# EasyEDA schematic hv-testbench-schematic.json
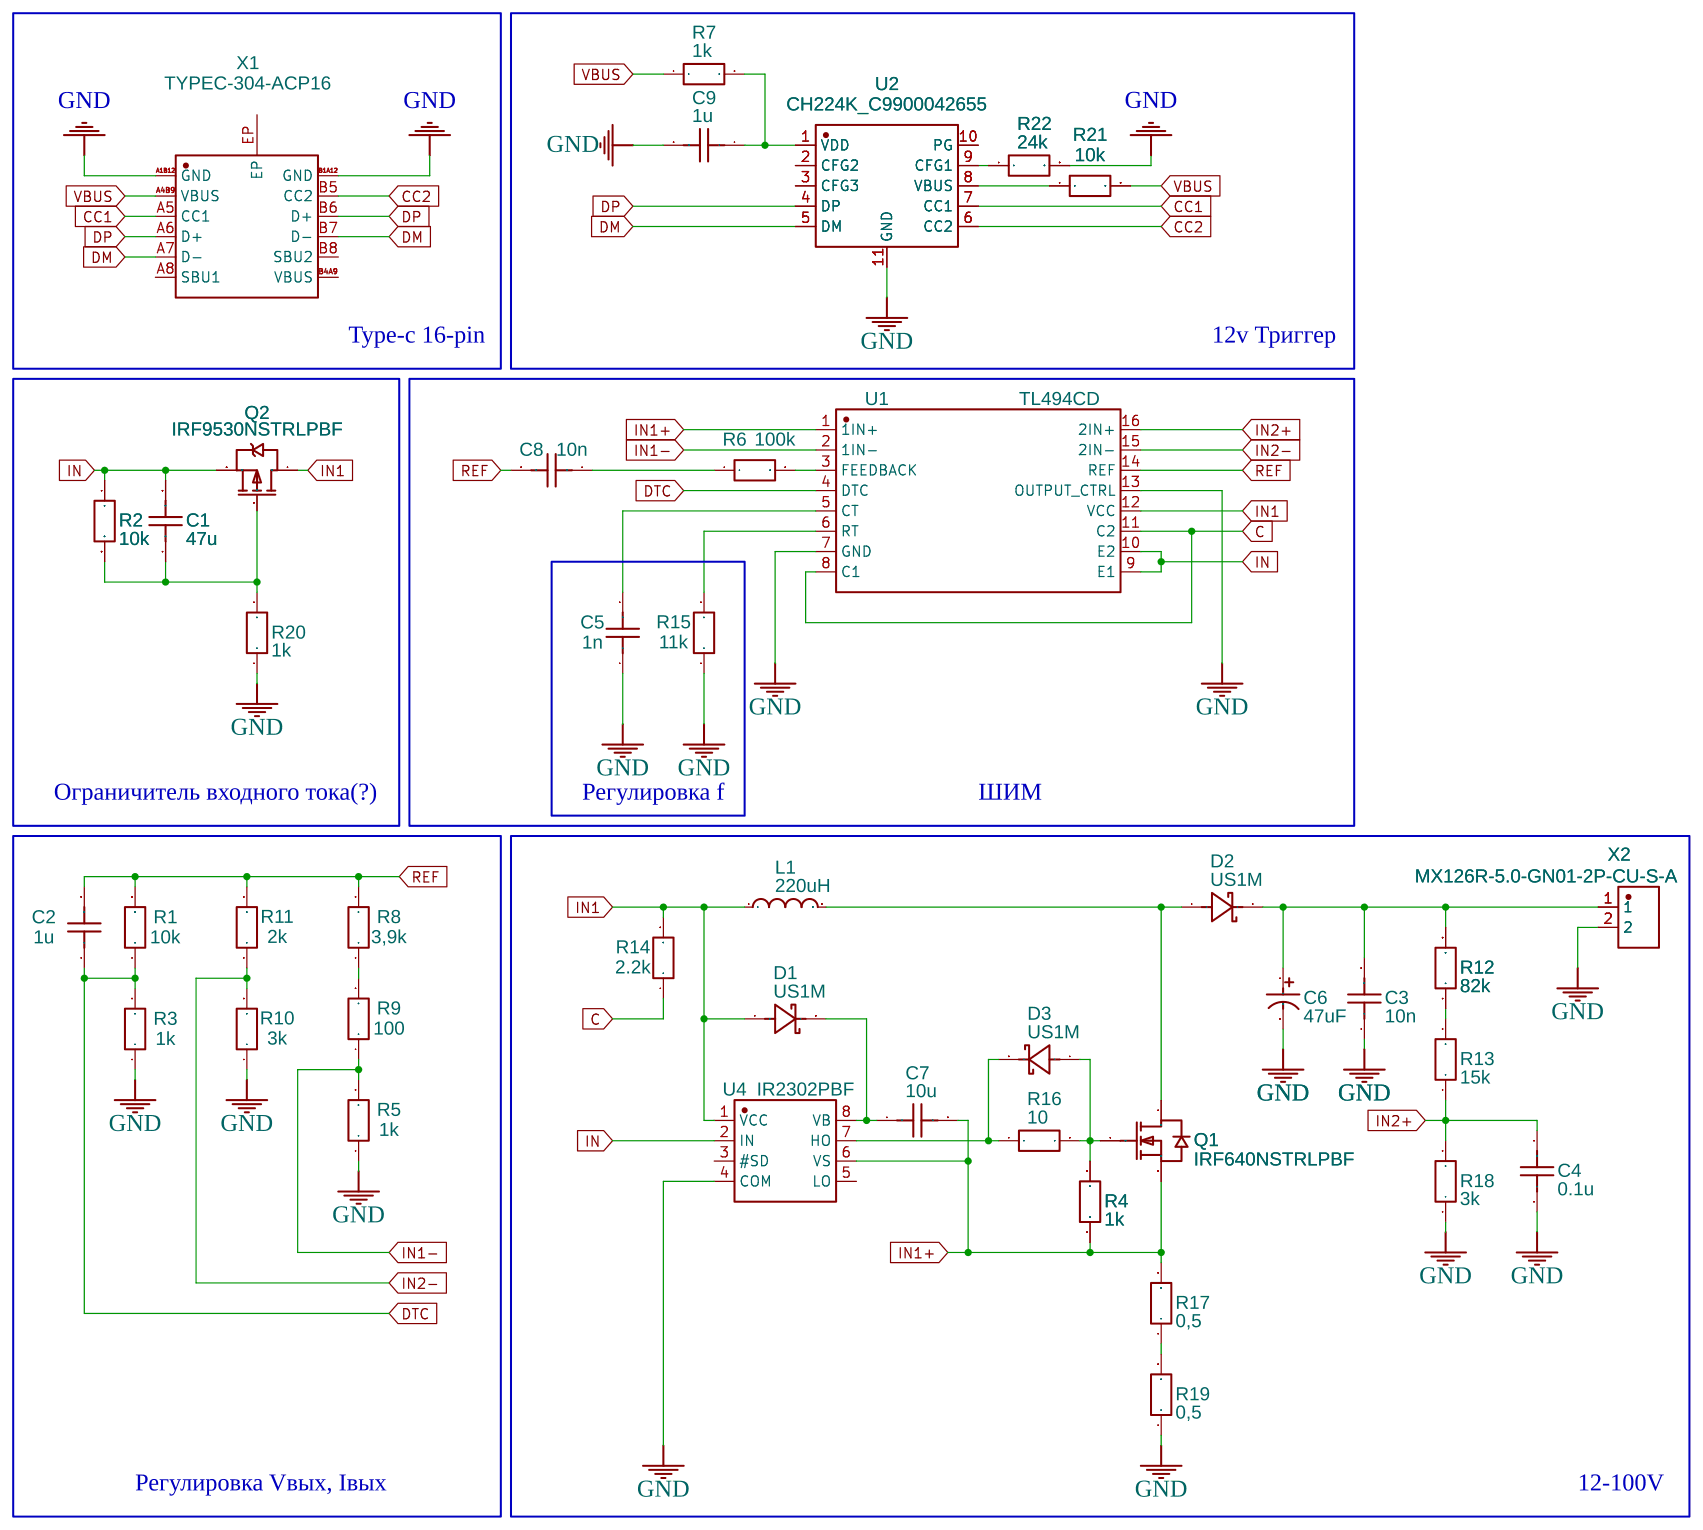
[diagram p0: schematic sheet]

## Parts
C1  47u  [C1206]
C2  1u  [C0805]
C3  10n  [C0805]
C4  0.1u  [C0805]
C5  1n  [C0402]
C6  47uF  [CAP-TH_BD13.0-P5.00-D1.2-FD]
C7  10u  [C0805]
C8  10n  [C0805]
C9  1u  [C0805]
D1  US1M  [SMA_L4.3-W2.6-LS5.0-FD]
D2  US1M  [SMA_L4.3-W2.6-LS5.0-FD]
D3  US1M  [SMA_L4.3-W2.6-LS5.0-FD]
L1  220uH  [IND-SMD_L12.5-W12.5]
Q1  IRF640NSTRLPBF  [TO-263-2_L10.0-W9.1-P5.08-LS15.2-TL]
Q2  IRF9530NSTRLPBF  [TO-263-2_L10.0-W9.1-P5.08-LS15.2-TL]
R1  10k  [R0805]
R2  10k  [R0805]
R3  1k  [R0805]
R4  1k  [R1206]
R5  1k  [R0805]
R6  100k  [R0805]
R7  1k  [R1206]
R8  3,9k  [R0805]
R9  100  [R0805]
R10  3k  [R0805]
R11  2k  [R0805]
R12  82k  [R1206]
R13  15k  [R0805]
R14  2.2k  [R0805]
R15  11k  [R0805]
R16  10  [R1206]
R17  0,5  [R2512]
R18  3k  [R0805]
R19  0,5  [R2512]
R20  1k  [R0805]
R21  10k  [R0805]
R22  24k  [R0805]
U1  TL494CD  [SOIC-16_L9.9-W3.9-P1.27-LS6.0-BL]
U2  CH224K_C9900042655  [ESSOP-10_L4.9-W3.9-P1.00-LS6.0-BL-EP]
U4  IR2302PBF  [PDIP-8_L9.3-W6.4-P2.54-LS7.6-BL]
X1  TYPEC-304-ACP16  [USB-C-SMD_TYPE-C-16P-1]
X2  MX126R-5.0-GN01-2P-CU-S-A  [CONN-TH_2P-P5.00-L10.0-W10.3]

## Library data of the parts
C1 = C_1206_US: Contributor: LCEDA_Lib
C2-C4 C7-C9 = C_0805_US: Contributor: LCEDA_Lib
C5 = C_0402_US: Contributor: LCEDA_Lib
C6 = 47uf/250V: Supplier: LCSC; Manufacturer: ReliaPro; Supplier Part: C2048
D1-D3 = US1M: Supplier: LCSC; Supplier Part: C7420317; Manufacturer: R+O(宏嘉诚); Contributor: lcsc; JLCPCB Part Class: Extended Part
L1 = B82477P4392M: Contributor: LCSC; Supplier: LCSC; Supplier Part: C515230; Manufacturer: TDK; JLCPCB Part Class: Extended Part
Q1 = IRF640NSTRLPBF: Supplier: LCSC; Manufacturer: Infineon(英飞凌); Supplier Part: C23708; JLCPCB Part Class: Extended Part
Q2 = IRF9530NSTRLPBF: Contributor: LCSC; Supplier: LCSC; Supplier Part: C157638; Manufacturer: Infineon(英飞凌); JLCPCB Part Class: Extended Part
R1-R3 R5 R6 R8-R11 R13-R15 R18 R20-R22 = R_0805_EU: Contributor: LCEDA_Lib
R4 R7 R12 R16 = R_1206_EU: Contributor: LCEDA_Lib
R17 R19 = R_2512_EU: Contributor: LCEDA_Lib
U1 = TL494CD: Contributor: lcsc; Supplier: LCSC; Supplier Part: C1530072; Manufacturer: TI(德州仪器); JLCPCB Part Class: Extended Part
U2 = CH224K_C9900042655: Contributor: lcsc; Supplier: LCSC; Supplier Part: C9900042655; Manufacturer: null; Manufacturer Part: CH224K
U4 = IR2302PBF: Contributor: LCSC; Supplier: LCSC; Supplier Part: C537625; Manufacturer: Infineon(英飞凌); JLCPCB Part Class: Extended Part
X1 = TYPEC-304-ACP16: Contributor: LCSC; Supplier: LCSC; Supplier Part: C2982555; Manufacturer: XUNPU(讯普); JLCPCB Part Class: Extended Part
X2 = MX126R-5.0-GN01-2P-CU-S-A: Supplier: LCSC; Supplier Part: C5188436; Manufacturer: MAX(迈旭); Manufacturer Part: MX126R-5.0-02P-GN01-Cu-S-A; Contributor: lcsc; JLCPCB Part Class: Extended Part

## Nets
GND: C3.1 C4.2 C5.1 C6.2 C9.2 R3.1 R5.1 R10.1 R15.1 R18.1 R19.1 R20.1 R22.2 U1.7(GND) U1.13(OUTPUT CTRL) U2.11(GND) U4.4(COM) X1.A1B12(GND) X1.B1A12(GND) X2.2
VBUS: R7.1 R21.2 X1.A4B9(VBUS)
C: R14.1 U1.8(C1) U1.11(C2)
CC1: U2.7(CC1) X1.A5(CC1)
CC2: U2.6(CC2) X1.B5(CC2)
DM: U2.5(DM) X1.A7(D-) X1.B7(D-)
DP: U2.4(DP) X1.A6(D+) X1.B6(D+)
DTC: C2.1 R1.1 R3.2 U1.4(DTC)
IN: C1.2 Q2.3(S) R2.1 U1.9(E1) U1.10(E2) U4.2(IN)
IN1: D1.1(A) L1.1 Q2.4(D) R14.2 U1.12(VCC) U4.1(VCC)
IN1+: C7.2 Q1.3(S) R4.1 R17.2 U1.1(1IN+) U4.6(VS)
IN1-: R5.2 R9.1 U1.2(1IN−)
IN2+: C4.1 R13.1 R18.2 U1.16(2IN+)
IN2-: R10.2 R11.1 U1.15(2IN−)
REF: C2.2 C8.2 R1.2 R8.2 R11.2 U1.14(REF)
Net-(C1-1): C1.1 Q2.1(G) R2.2 R20.2
Net-(C3-2): C3.2 C6.1 D2.2(K) R12.2 X2.1
Net-(C5-2): C5.2 U1.5(CT)
Net-(C7-1): C7.1 D1.2(K) U4.8(VB)
Net-(C8-1): C8.1 R6.1
Net-(C9-1): C9.1 R7.2 U2.1(VDD)
Net-(D2-1): D2.1(A) L1.2 Q1.4(D)
Net-(D3-1): D3.1(A) Q1.1(G) R4.2 R16.2
Net-(D3-2): D3.2(K) R16.1 U4.7(HO)
Net-(R6-2): R6.2 U1.3(FEEDBACK)
Net-(R8-1): R8.1 R9.2
Net-(R12-1): R12.1 R13.2
Net-(R15-2): R15.2 U1.6(RT)
Net-(R17-1): R17.1 R19.2
Net-(R21-1): R21.1 U2.8(VBUS)
Net-(R22-1): R22.1 U2.9(CFG1)

Not connected (* = marked no-connect by the designer): U2 2(CFG2) 3(CFG3) 10(PG); U4 3(#SD) 5(LO); X1 A8(SBU1) B4A9(VBUS) B8(SBU2) EP

## Notes on the sheet
- Type-c 16-pin
- 12v Триггер
- Ограничитель входного тока(?)
- Регулировка f
- ШИМ
- Регулировка Vвых, Iвых
- 12-100V
